# EAGLE design SC70-6-normal (EAGLE 6.5.0)
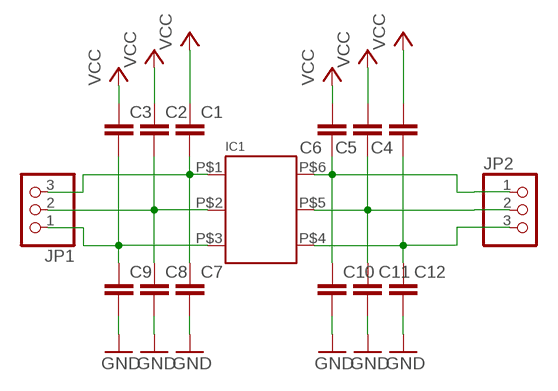
[diagram p0: schematic, sheet 1]

## Parts
C1  C-EUC0805  [C0805]
C2  C-EUC0805  [C0805]
C3  C-EUC0805  [C0805]
C4  C-EUC0805  [C0805]
C5  C-EUC0805  [C0805]
C6  C-EUC0805  [C0805]
C7  C-EUC0603  [C0603]
C8  C-EUC0603  [C0603]
C9  C-EUC0603  [C0603]
C10  C-EUC0603  [C0603]
C11  C-EUC0603  [C0603]
C12  C-EUC0603  [C0603]
IC1  FOOTPRINT-6-PINSC70  [SC-70/6]
JP1  PINHD-1X3  [1X03]
JP2  PINHD-1X3  [1X03]

## Nets
1: C1.2 C7.1 IC1.P$1 JP1.3
2: C2.2 C8.1 IC1.P$2 JP1.2
3: C3.2 C9.1 IC1.P$3 JP1.1
4: C4.1 C12.1 IC1.P$4 JP2.3
5: C5.1 C11.1 IC1.P$5 JP2.2
6: C6.1 C10.1 IC1.P$6 JP2.1
GND: C7.2 C8.2 C9.2 C10.2 C11.2 C12.2
VCC: C1.1 C2.1 C3.1 C4.2 C5.2 C6.2

## Library data of the parts
C1-C12 = p.peter-rcl:C-EU: CAPACITOR, European symbol
IC1 = p.peter-doc:FOOTPRINT-6-PIN
JP1 JP2 = pinhead:PINHD-1X3: PIN HEADER

## Board
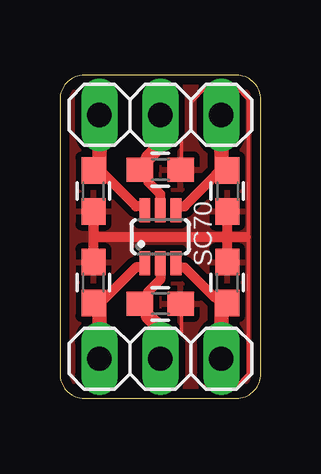
[diagram p1: board, top side]
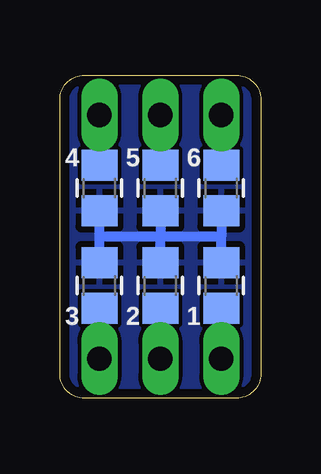
[diagram p2: board, bottom side, seen from below]

Size 8.38 x 13.46 mm. Coordinates in mm from the lower left corner, seen from the top.
Outline: 1.02,0 7.37,0 arc90 8.38,1.02 8.38,12.45 arc90 7.37,13.46 7.11,13.46 1.02,13.46 arc90 0,12.45 0,1.02 arc90 1.02,0
Copper layers (1*16): Top 0.0356mm / dielectric 1.5011mm / Bottom 0.0356mm
Design rules "oshpark": minimum track width 6mil, minimum drill 13mil, track to track 6mil, track to pad 6mil, pad to pad 6mil, via to via 6mil, smd to smd 6mil, copper to edge 15mil, drill to drill 6mil, minimum pad ring 7mil, minimum via ring 7mil, stop-mask expansion 4mil, vias tented up to drill 4.1mm, thermal gap 10mil

### Footprints (pad centres in the part's own frame; a part is rotated, then mirrored left to right if it is on the bottom)
C0805 = smd 1.3 x 1.5: 1 -0.95,0; 2 0.95,0
C0603 = smd 1.1 x 1: 1 -0.85,0; 2 0.85,0
SC-70/6 = smd 0.45 x 1: P$1 -0.65,-1.1; P$2 0,-1.1; P$3 0.65,-1.1; P$4 0.65,1.1; P$5 0,1.1; P$6 -0.65,1.1
1X03 = drill 1.016 long: 1 -2.54,0; 2 0,0; 3 2.54,0

### Placement (x,y rotation side)
C1  1.65,4.7 270 bottom
C2  4.19,4.7 270 bottom
C3  6.73,4.7 270 bottom
C4  6.73,8.76 270 bottom
C5  4.19,8.76 270 bottom
C6  1.65,8.76 270 bottom
C7  1.4,4.83 90 top
C8  4.19,3.94 0 top
C9  6.98,4.83 90 top
C10  1.4,8.64 270 top
C11  4.19,9.53 0 top
C12  6.98,8.64 270 top
IC1  4.19,6.73 0 top
JP1  4.19,1.65 180 top
JP2  4.19,11.81 0 top

### Tracks (layer width: path | path; a pad name or v marks a point on that pad's centre or on a via)
1
  Top 0.406: 1.65,3.56 1.65,3.72 C7.1 | IC1.P$1 3.54,5.48 3.56,5.46 3.43,5.46 3.17,5.46 1.91,4.19 1.65,3.94
  Top 0.61: JP1.3 1.65,3.56 1.65,3.94
  Bottom 0.61: C1.2 JP1.3
2
  Top 0.406: IC1.P$2 4.19,4.95 3.94,4.7 3.68,4.44 | 3.68,4.44 3.68,3.94 | 3.68,3.94 3.68,3.43 | 3.68,4.44 3.68,3.94 | 3.68,3.94 C8.1
  Top 0.61: 3.68,3.43 4.19,2.92 JP1.2
  Bottom 0.61: C2.2 JP1.2
3
  Top 0.406: IC1.P$3 4.84,5.48 4.83,5.46 4.95,5.46 5.21,5.46 6.48,4.19 7.02,4.19 C9.1 6.73,4.1
  Top 0.61: JP1.1 6.73,4.1
  Bottom 0.61: C3.2 JP1.1
4
  Top 0.406: IC1.P$4 4.84,7.99 4.83,8 4.95,8 5.21,8 6.22,9.02 6.48,9.27 6.73,9.53 6.9,9.53 C12.1 6.9,9.61
  Top 0.61: 6.9,9.61 6.73,9.53 JP2.3
  Bottom 0.61: C4.1 JP2.3
5
  Top 0.406: IC1.P$5 4.19,8.51 3.68,9.02 3.68,9.53 | 3.68,9.53 3.68,10.03 3.68,9.53 | 3.68,9.53 C11.1
  Top 0.61: 3.68,10.03 4.19,10.54 JP2.2
  Bottom 0.61: C5.1 JP2.2
6
  Top 0.406: 1.65,9.87 C10.1 | 1.65,9.53 1.91,9.27 3.17,8 3.56,8 3.54,7.99 IC1.P$6
  Top 0.61: JP2.1 1.65,9.87 1.65,9.53
  Bottom 0.61: C6.1 JP2.1
GND
  Top 0.152: 7.87,6.73 7.87,1.02 7.37,0.51 5.97,0.51 5.46,1.02 5.46,2.29 5.08,2.67 5.08,3.81 4.95,3.81 | 7.87,6.73 7.87,12.45 7.37,12.95 6.1,12.95 5.46,12.32 5.46,11.18 5.08,10.79 5.08,9.56 C11.2 | 7.75,6.73 7.87,6.73 | 4.95,3.85 C8.2
  Top 0.406: C9.2 6.98,6.6 | 6.98,6.6 C12.2 | C7.2 1.4,6.73 | 1.4,6.73 C10.2 1.4,6.73 | 1.4,6.73 6.73,6.73 | 6.73,6.73 6.86,6.73 6.98,6.6 | 6.73,6.73 7.75,6.73
  pour Top (isolate 0.254): -0.25,-0.25 -0.25,13.72 8.64,13.72 8.64,-0.25
VCC
  Bottom 0.406: C1.1 1.65,6.73 | 6.73,6.73 C4.2 | C6.2 1.65,6.73 | C5.2 4.19,6.73 | C2.1 4.19,6.73 | C3.1 6.73,6.73 | 1.65,6.73 4.19,6.73 | 4.19,6.73 6.73,6.73
  pour Bottom: -0.25,-0.25 -0.25,13.72 8.64,13.72 8.64,-0.25

### Text on the board
tPlace: SC70
bPlace: 6 | 5 | 4 | 1 | 2 | 3